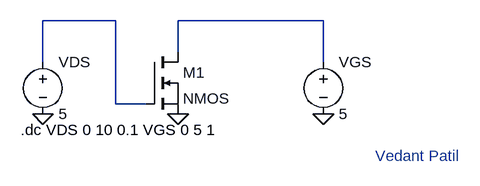
[diagram p0: schematic Draft1.asc]
Draft1.asc, the LTspice schematic file:
Version 4
SHEET 1 880 680
WIRE 16 64 -96 64
WIRE 336 64 112 64
WIRE 112 112 112 64
WIRE -96 128 -96 64
WIRE 336 128 336 64
WIRE 16 192 16 64
WIRE 64 192 16 192
FLAG -96 208 0
FLAG 336 208 0
FLAG 112 208 0
SYMBOL nmos 64 112 R0
SYMATTR InstName M1
SYMBOL voltage -96 112 R0
SYMATTR InstName VDS
SYMATTR Value 5
SYMBOL voltage 336 112 R0
SYMATTR InstName VGS
SYMATTR Value 5
TEXT -130 232 Left 2 !.dc VDS 0 10 0.1 VGS 0 5 1
TEXT 416 272 Left 2 ;Vedant Patil

The netlist it stands for:
* Draft1.asc
M1 N002 N001 0 0 NMOS
VDS N001 0 5
VGS N002 0 5
.model NMOS NMOS
.model PMOS PMOS
.lib standard.mos
.dc VDS 0 10 0.1 VGS 0 5 1
* Vedant Patil
.backanno
.end